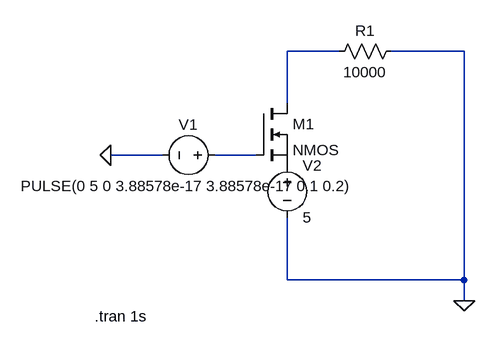
[diagram p0: schematic MOSFET_Switch.asc]
MOSFET_Switch.asc, the LTspice schematic file:
Version 4.1
SHEET 1 880 680
WIRE 480 -208 400 -208
WIRE 672 -208 560 -208
WIRE 400 -128 400 -208
WIRE 208 -48 128 -48
WIRE 352 -48 288 -48
WIRE 400 144 400 48
WIRE 672 144 672 -208
WIRE 672 144 400 144
WIRE 672 176 672 144
FLAG 128 -48 0
FLAG 672 176 0
SYMBOL voltage 304 -48 R90
WINDOW 0 -32 56 VBottom 2
WINDOW 3 32 56 VTop 2
WINDOW 123 0 0 Left 0
WINDOW 39 0 0 Left 0
SYMATTR InstName V1
SYMATTR Value PULSE(0 5 0 3.88578e-17 3.88578e-17 0.1 0.2)
SYMBOL nmos 352 -128 R0
SYMATTR InstName M1
SYMBOL voltage 400 -48 R0
WINDOW 123 0 0 Left 0
WINDOW 39 0 0 Left 0
SYMATTR InstName V2
SYMATTR Value 5
SYMBOL res 576 -224 R90
WINDOW 0 0 56 VBottom 2
WINDOW 3 32 56 VTop 2
SYMATTR InstName R1
SYMATTR Value 10000
TEXT 104 200 Left 2 !.tran 1s

The netlist it stands for:
* MOSFET_Switch.asc
V1 N002 0 PULSE(0 5 0 3.88578e-17 3.88578e-17 0.1 0.2)
M1 N001 N002 P001 P001 NMOS
V2 P001 0 5
R1 0 N001 10000
.model NMOS NMOS
.model PMOS PMOS
.lib standard.mos
.tran 1s
.backanno
.end